# Altium schematic sheet Sch_Motor.SchDoc: Control de Domótica
size A4; Author: Francisco González González - Eugenia Ipar; CompanyName: Control de los Motores; DocumentNumber: 8; SheetNumber: 8; SheetTotal: 12; Materia: Técnicas Digitales II; Placa: Conexión a Motores; Year: 2015; Prof1: Prof: Alarcón, Juan; Prof2: Ayud: Crivelli, Marcelo; Prof3: Ayud: Montalti, Pablo; PageSetup: Record=PageOptions|CenterHorizontal=True|CenterVertical=True|PrintScale=1.00|XCorrection=1.00|YCorrection=1.00|PrintKind=0|BorderSize=5000000|LeftOffset=0|BottomOffset=0|Orientation=2|PaperLength=1000|PaperWidth=1000|Scale=100|PaperSource=7|PrintQuality=-3|MediaType=1|DitherType=10|PrintScaleMode=1|PaperKind=A4|PaperIndex=9
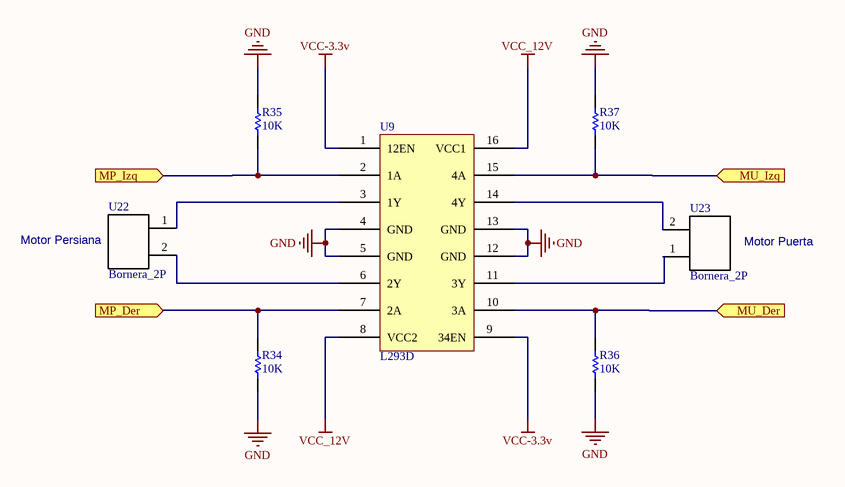
[diagram p0: Sch_Motor.SchDoc]

## Parts
R34  value 10K  [AXIAL-0.3]  (hidden comment: Res1)
R35  value 10K  [AXIAL-0.3]  (hidden comment: Res1)
R36  value 10K  [AXIAL-0.3]  (hidden comment: Res1)
R37  value 10K  [AXIAL-0.3]  (hidden comment: Res1)
U9  L293D  [DIP16]
U22  Bornera_2P  [Bornera]
U23  Bornera_2P  [Bornera]

## Ports
MP_Der (in), MP_Izq (in), MU_Der (in), MU_Izq (in)

## Nets
GND: R34.1 R35.2 R36.1 R37.2 U9.4(GND) U9.5(GND) U9.12(GND) U9.13(GND)
VCC-3.3v: U9.1(12EN) U9.9(34EN)
VCC_12V: U9.8(VCC2) U9.16(VCC1)
MP_Der: R34.2 U9.7(2A) ; port MP_Der
MP_Izq: R35.1 U9.2(1A) ; port MP_Izq
MU_Der: R36.2 U9.10(3A) ; port MU_Der
MU_Izq: R37.1 U9.15(4A) ; port MU_Izq
NetU9_3: U9.3(1Y) U22.1
NetU9_6: U9.6(2Y) U22.2
NetU9_11: U9.11(3Y) U23.1
NetU9_14: U9.14(4Y) U23.2

## Notes on the sheet
- (near U22) Motor Persiana
- Motor Puerta
- Sheet
- of

## Library data of the parts
R34-R37 = Res1: Resistor; Published: 8-Jun-2000; LatestRevisionDate: 17-Jul-2002; LatestRevisionNote: Re-released for DXP Platform.; PackageReference: AXIAL-0.3; Publisher: Altium Limited; PackageDescription: Axial Device, Thru-Hole; 2 Leads; 0.3 in Pin Spacing
U9 = L293D: Texas Quadruple Half-H Drivers